# EAGLE schematic rpisupply (EAGLE 7.5.0)
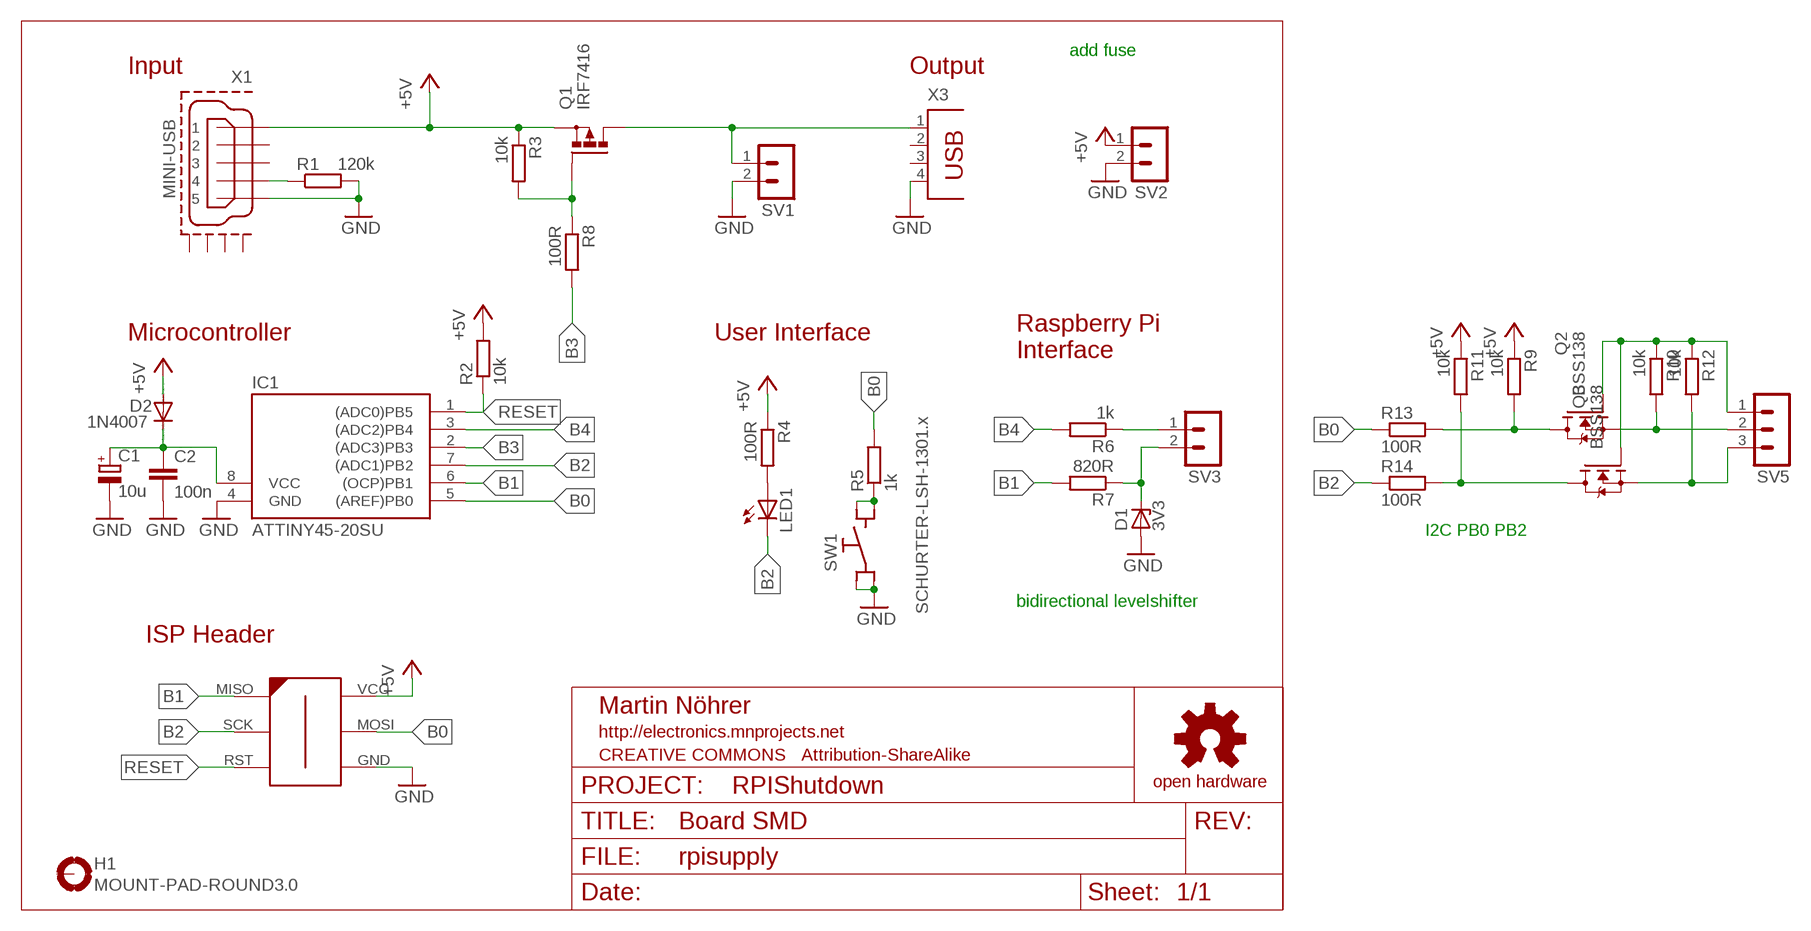
[diagram p0: schematic, sheet 1]

## Parts
C1  10u  CPOL-EUSMCC  [SMC_C]
C2  100n  C-EUC0805  [C0805]
D1  3V3  ZENER-DIODESOD80C  [SOD80C]
D2  1N4007  DIODE-MELF-MLL41  [MELF-MLL41]
H1  MOUNT-PAD-ROUND3.0  [3,0-PAD]
IC1  ATTINY45-20SU  TINY25/45/85-20SU  [SOIC8]
LED1  LEDSML0805  [SML0805]
Q1  IRF7416  P-MOSFET-SO8  [SO-08]
Q2  BSS138  BSS138BSS138  [SOT23]
Q3  BSS138  BSS138BSS138  [SOT23]
R1  120k  R-EU_R0805  [R0805]
R2  10k  R-EU_R0805  [R0805]
R3  10k  R-EU_R0805  [R0805]
R4  100R  R-EU_R0805  [R0805]
R5  1k  R-EU_R0805  [R0805]
R6  1k  R-EU_R0805  [R0805]
R7  820R  R-EU_R0805  [R0805]
R8  100R  R-EU_R0805  [R0805]
R9  10k  R-EU_R0805  [R0805]
R10  10k  R-EU_R0805  [R0805]
R11  10k  R-EU_R0805  [R0805]
R12  10k  R-EU_R0805  [R0805]
R13  100R  R-EU_R0805  [R0805]
R14  100R  R-EU_R0805  [R0805]
SV1  MA02-1R  [MA02-1]
SV2  MA02-1R  [MA02-1]
SV3  MA02-1R  [MA02-1]
SV5  MA03-1R  [MA03-1]
SW1  SCHURTER-LSH-1301.x  SCHURTER-LSH-1301.9319  [LSH]
X1  MINI-USB  MINI-USB-SHIELD-UX60-MB-5ST  [UX60-MB-5ST]
X2  AVR-ISP-6-EDGE  [6PAD_ISP]
X3  PN87520  [PN87520]

## Nets
+5V: D2.A Q1.1(S) Q1.2(S) Q1.3(S) R2.2 R3.1 R4.1 R9.1 R11.1 SV2.1 X1.1 X2.VCC
B0: IC1.5((AREF)PB0) R5.2 R13.1 X2.MOSI
B1: IC1.6((OCP)PB1) R7.2 X2.MISO
B2: IC1.7((ADC1)PB2) LED1.C R14.1 X2.SCK
B3: IC1.2((ADC3)PB3) R8.2
B4: IC1.3((ADC2)PB4) R6.2
GND: C1.- C2.2 D1.A IC1.4(GND) R1.2 SV1.2 SV2.2 SW1.C1(C) SW1.C2(C) X1.5 X2.GND X3.4
N$1: R6.1 SV3.1
N$2: D1.C R7.1 SV3.2
N$3: R1.1 X1.4
N$4: LED1.A R4.2
N$5: R5.1 SW1.NO1(NO) SW1.NO2(NO)
N$6: Q1.4(G) R3.2 R8.1
N$7: C1.+ C2.1 D2.C IC1.8(VCC)
N$8: Q2.1(G) Q3.1(G) R10.1 R12.1 SV5.1
N$9: Q2.2(S) R10.2 SV5.2
N$10: Q3.3(D) R11.2 R14.2
N$11: Q3.2(S) R12.2 SV5.3
N$12: Q2.3(D) R9.2 R13.2
N$21: Q1.5(D) Q1.6(D) Q1.7(D) Q1.8(D) SV1.1 X3.1
RESET: IC1.1((ADC0)PB5) R2.1 X2.RST
Unconnected: H1.B3,0(MOUNT) X1.2 X1.3 X1.M1(GND1) X1.M2(GND2) X1.M3(GND3) X1.M4(GND4) X3.2 X3.3

## Notes on the sheet
- add fuse
- Input | Output
- Microcontroller | User Interface
- Raspberry Pi
  Interface
- I2C PB0 PB2
- bidirectional levelshifter
- ISP Header
- RPIShutdown
- Board SMD

## Library data of the parts
C1 = rcl:CPOL-EU: POLARIZED CAPACITOR, European symbol
C2 = rcl:C-EU: CAPACITOR, European symbol
D1 = diode:ZENER-DIODE: Z-Diode
D2 = diode:DIODE-: DIODE
H1 = holes:MOUNT-PAD-ROUND: MOUNTING PAD, round
IC1 = avr-7:TINY25/45/85
LED1 = led:LED: LED OSRAM: - CHIPLED LG R971, LG N971, LY N971, LG Q971, LY Q971, LO R971, LY R971 LH N974, LH R974 LS Q976, LO Q976, LY Q976 LO Q996 - Hyper CHIPLED LW Q18S LB Q993, LB Q99A, LB R99A - SideLED LS A670, LO A670, LY A670, LG A670, LP A670 LB A673, LV A673, LT A673, LW A673 LH A674 LY A675 LS A676, LA A676, LO A676, LY A676, LW A676 LS A679, LY A679, LG A679 - Hyper Micro SIDELED® LS Y876, LA Y876, LO Y876, LY Y876 LT Y87S - SmartLED LW L88C, LW L88S LB L89C, LB L89S, LG L890 LS L89K, LO L89K, LY L89K LS L896, LA L896, LO L896, LY L896 - TOPLED LS T670, LO T670, LY T670, LG T670, LP T670 LSG T670, LSP T670, LSY T670, LOP T670, LYG T670 LG T671, LOG T671, LSG T671 LB T673, LV T673, LT T673, LW T673 LH T674 LS T676, LA T676, LO T676, LY T676, LB T676, LH T676, LSB T676, LW T676 LB T67C, LV T67C, LT T67C, LS T67K, LO T67K, LY T67K, LW E67C LS E67B, LA E67B, LO E67B, LY E67B, LB E67C, LV E67C, LT E67C LW T67C LS T679, LY T679, LG T679 LS T770, LO T770, LY T770, LG T770, LP T770 LB T773, LV T773, LT T773, LW T773 LH T774 LS E675, LA E675, LY E675, LS T675 LS T776, LA T776, LO T776, LY T776, LB T776 LHGB T686 LT T68C, LB T68C - Hyper Mini TOPLED® LB M676 - Mini TOPLED Santana® LG M470 LS M47K, LO M47K, LY M47K Source: http://www.osram.convergy.de LUXEON: - LUMILED® LXK2-PW12-R00, LXK2-PW12-S00, LXK2-PW14-U00, LXK2-PW14-V00 LXK2-PM12-R00, LXK2-PM12-S00, LXK2-PM14-U00 LXK2-PE12-Q00, LXK2-PE12-R00, LXK2-PE12-S00, LXK2-PE14-T00, LXK2-PE14-U00 LXK2-PB12-K00, LXK2-PB12-L00, LXK2-PB12-M00, LXK2-PB14-N00, LXK2-PB14-P00, LXK2-PB14-Q00 LXK2-PR12-L00, LXK2-PR12-M00, LXK2-PR14-Q00, LXK2-PR14-R00 LXK2-PD12-Q00, LXK2-PD12-R00, LXK2-PD12-S00 LXK2-PH12-R00, LXK2-PH12-S00 LXK2-PL12-P00, LXK2-PL12-Q00, LXK2-PL12-R00 Source: www.luxeon.com KINGBRIGHT: KA-3528ASYC Source: www.kingbright.com
Q1 = transistor-power:P-MOSFET-SO8: P-Channel MOSFET Example: FDS4435A; P-Channel Logic Level PowerTrench® MOSFET FDS4465; P-Channel 1.8V Specified PowerTrench® MOSFET Source: www.fairchildsemi.com
Q2 Q3 = transistor-fet:BSS138
R1-R14 = rcl:R-EU_: RESISTOR, European symbol
SV1-SV3 = con-lstb:MA02-1R
SV5 = con-lstb:MA03-1R: PIN HEADER; OC_FARNELL: unknown; OC_NEWARK: unknown
SW1 = _schurter_LPH_LPS_LSH_SMS:SCHURTER-LSH-*: Schurter LSH Printmount Switches, Gullwing Leads [SMT] Momentary Action: Normally Open (NO) (6.0 x 6.0)mm Body Dim. Note: using same package drawing for actuator diam. (3.00 … 3.40)mm Source: www.schurter.com Actuator Diam. mm / Overall Height mm / Schurter # -------------------------------------------------------------- 3.40 / 04.30 / 1301.9314.xx 3.40 / 05.00 / 1301.9315.xx 3.20 / 07.00 / 1301.9316.xx 3.30 / 07.30 / 1301.9317.xx 3.10 / 08.00 / 1301.9319.xx 3.00 / 12.50 / 1301.9320.xx xx: denotes packaging, see Schurter data sheets Author: Dipl.-Ing. FH Rainer Bayer Hochschule Heilbronn HHN: rainer.bayer@hs-heilbronn.de − http://www.hs-heilbronn.de/rainer.bayer Ingenieurbüro ing-rb: mail@ing-rb.de − http://www.ing-rb.de/
X1 = usb_con-update:MINI-USB-SHIELD-: MINI USB Connector Source: http://www.hirose.co.jp/cataloge_hp/e24000019.pdf
X2 = avr-7:AVR-ISP-6-EDGE: 6 pin edge connector for ISP with ATMEL MCUs. Developed by Craig Moates (craig at moates dot net). Library by David Blundell (blundar at gmail dot com). Often, even a 6 pin header is really inconvenient for board layout and/or production. This SMD-only header is our de-facto standard for using an edge connector for programming with the help of a 6pin/10pin to edge card adapter.
X3 = con-berg:PN87520: BERG USB connector; OC_FARNELL: unknown; OC_NEWARK: unknown